# EAGLE design X-A4U-RGB (EAGLE 7.1.0)
REVISION: r2.1
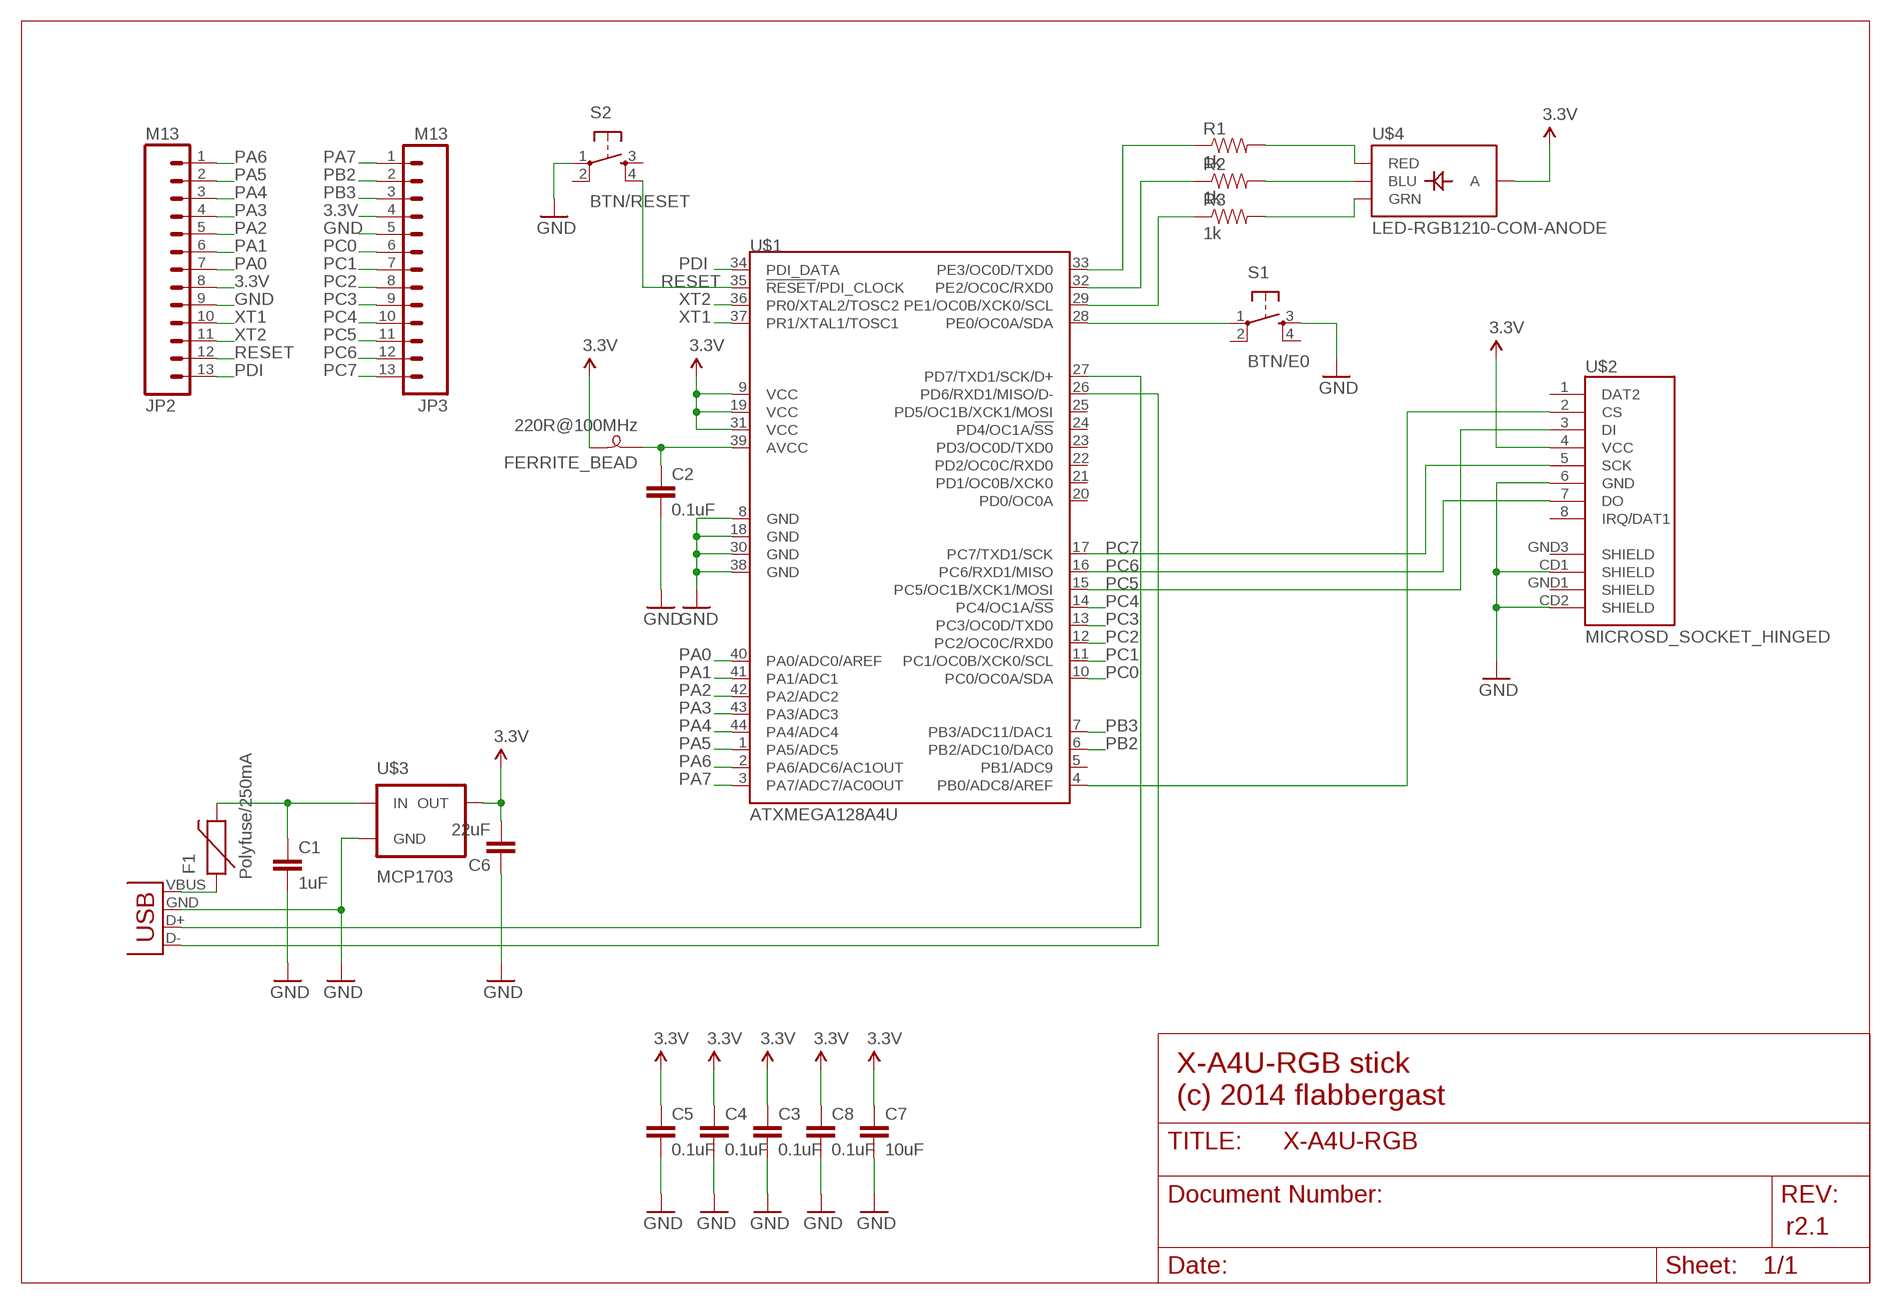
[diagram p0: schematic, sheet 1]

## Parts
C1  1uF  CAPACITOR0805  [0805]
C2  0.1uF  CAPACITOR0805  [0805]
C3  0.1uF  CAPACITOR0805  [0805]
C4  0.1uF  CAPACITOR0805  [0805]
C5  0.1uF  CAPACITOR0805  [0805]
C6  22uF  CAP1206  [1206]
C7  10uF  CAPACITOR1206  [1206]
C8  0.1uF  CAPACITOR1206  [1206]
F1  Polyfuse/250mA  PTCSMD-W  [PTC-1206-WIDE]
FERRITE_BEAD  220R@100MHz  FERRITE-BEAD0805  [0805]
JP1  USB-A-H  [USB-A-H]
JP2  M13  [1X13]
JP3  M13  [1X13]
R1  1k  RESISTOR0805  [0805]
R2  1k  RESISTOR0805  [0805]
R3  1k  RESISTOR0805  [0805]
S1  BTN/E0  TAC_SWITCHSMD  [TACTILE-SWITCH-SMD]
S2  BTN/RESET  TAC_SWITCHSMD  [TACTILE-SWITCH-SMD]
U$1  ATXMEGA128A4U  [TQFP-44]
U$2  MICROSD_SOCKET_HINGED  MICROSD_SOCKET_SLIDE  [MICROSD_SOCKET_SLIDE]
U$3  MCP1703  [SOT-89]
U$4  LED-RGB1210-COM-ANODE  [LED-RGB-1210]

## Nets
3.3V: C3.1 C4.1 C5.1 C6.2 C7.1 C8.1 FERRITE_BEAD.2 JP2.8 JP3.4 U$1.9(VCC) U$1.19(VCC) U$1.31(VCC) U$2.4(VCC) U$3.3(OUT) U$4.A
GND: C1.2 C2.2 C3.2 C4.2 C5.2 C6.1 C7.2 C8.2 JP1.GND(VBUS) JP2.9 JP3.5 S1.3 S2.1 U$1.8(GND) U$1.18(GND) U$1.30(GND) U$1.38(GND) U$2.6(GND) U$2.CD1(SHIELD) U$2.CD2(SHIELD) U$3.1(GND)
N$1: JP1.D+(D-) U$1.27(PD7/TXD1/SCK/D+)
N$2: JP1.D-(D+) U$1.26(PD6/RXD1/MISO/D-)
N$3: F1.1 JP1.VBUS(GND)
N$4: R3.1 U$1.29(PE1/OC0B/XCK0/SCL)
N$5: S1.1 U$1.28(PE0/OC0A/SDA)
N$6: C2.1 FERRITE_BEAD.1 U$1.39(AVCC)
N$7: U$1.4(PB0/ADC8/AREF) U$2.2(CS)
N$9: R2.1 U$1.32(PE2/OC0C/RXD0)
N$10: R1.1 U$1.33(PE3/OC0D/TXD0)
N$11: R1.2 U$4.R(RED)
N$12: R3.2 U$4.G(GRN)
N$13: R2.2 U$4.B(BLU)
PA0: JP2.7 U$1.40(PA0/ADC0/AREF)
PA1: JP2.6 U$1.41(PA1/ADC1)
PA2: JP2.5 U$1.42(PA2/ADC2)
PA3: JP2.4 U$1.43(PA3/ADC3)
PA4: JP2.3 U$1.44(PA4/ADC4)
PA5: JP2.2 U$1.1(PA5/ADC5)
PA6: JP2.1 U$1.2(PA6/ADC6/AC1OUT)
PA7: JP3.1 U$1.3(PA7/ADC7/AC0OUT)
PB2: JP3.2 U$1.6(PB2/ADC10/DAC0)
PB3: JP3.3 U$1.7(PB3/ADC11/DAC1)
PC0: JP3.6 U$1.10(PC0/OC0A/SDA)
PC1: JP3.7 U$1.11(PC1/OC0B/XCK0/SCL)
PC2: JP3.8 U$1.12(PC2/OC0C/RXD0)
PC3: JP3.9 U$1.13(PC3/OC0D/TXD0)
PC4: JP3.10 U$1.14(PC4/OC1A/!SS!)
PC5: JP3.11 U$1.15(PC5/OC1B/XCK1/MOSI) U$2.3(DI)
PC6: JP3.12 U$1.16(PC6/RXD1/MISO) U$2.7(DO)
PC7: JP3.13 U$1.17(PC7/TXD1/SCK) U$2.5(SCK)
PDI: JP2.13 U$1.34(PDI_DATA)
RESET: JP2.12 S2.4 U$1.35(!RESET!/PDI_CLOCK)
VBUS: C1.1 F1.2 U$3.2(IN) U$3.4(IN)
XT1: JP2.10 U$1.37(PR1/XTAL1/TOSC1)
XT2: JP2.11 U$1.36(PR0/XTAL2/TOSC2)
Unconnected: S1.2 S1.4 S2.2 S2.3 U$1.5(PB1/ADC9) U$1.20(PD0/OC0A) U$1.21(PD1/OC0B/XCK0) U$1.22(PD2/OC0C/RXD0) U$1.23(PD3/OC0D/TXD0) U$1.24(PD4/OC1A/!SS!) U$1.25(PD5/OC1B/XCK1/MOSI) U$2.1(DAT2) U$2.8(IRQ/DAT1) U$2.GND1(SHIELD) U$2.GND3(SHIELD)

## Notes on the sheet
- X-A4U-RGB stick
  (c) 2014 flabbergast

## Library data of the parts
C1-C5 C7 C8 = flabbergast:CAPACITOR
C6 = SparkFun-Passives:CAP: Capacitor Standard 0603 ceramic capacitor, and 0.1" leaded capacitor.
F1 = SparkFun-PowerIC:PTC: Resettable Fuse PTC Resettable Fuse. Spark Fun Electronics SKU : COM-08357
FERRITE_BEAD = flabbergast:FERRITE-BEAD
JP1 = SparkFun-Connectors:USB: USB Connectors USB-B-PTH is fully proven SKU : PRT-00139/CONN-08278 USB-miniB is fully proven SKU : PRT-00587 USB-A-PCB is untested. USB-A-H is throughly reviewed, but untested. Spark Fun Electronics SKU : PRT-00437 USB-B-SMT is throughly reviewed, but untested. Needs silkscreen touching up. USB-A-S has not been used/tested USB-MB-H has not been used/tested USB-MICROB has been used. CONN-09505
JP2 JP3 = SparkFun-Connectors:M13: 13-pin single row .1" header
R1-R3 = flabbergast:RESISTOR
S1 S2 = SparkFun-Electromechanical:TAC_SWITCH: Momentary Switch Button commonly used for reset or general input. Spark Fun Electronics SKU : COM-00097 SMT- SWCH-08247; PROD_ID: SWCH-08247; VALUE: TAC_SWITCHSMD
U$1 = flabbergast:ATXMEGA128A4U
U$2 = flabbergast:MICROSD_SOCKET
U$3 = flabbergast:MCP1703
U$4 = flabbergast:LED-RGB

## Board
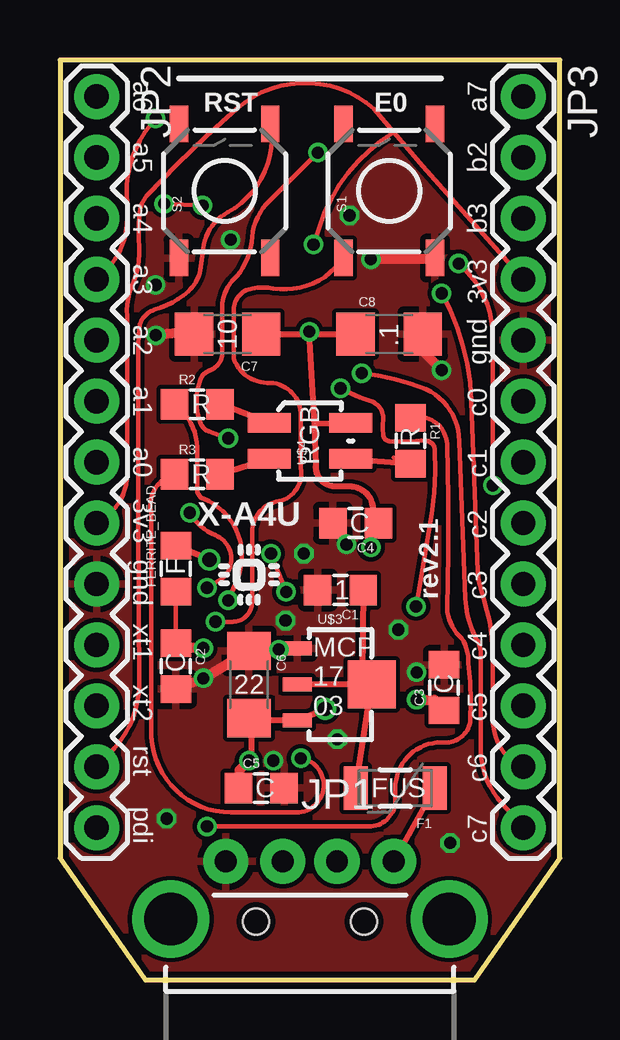
[diagram p1: board, top side]
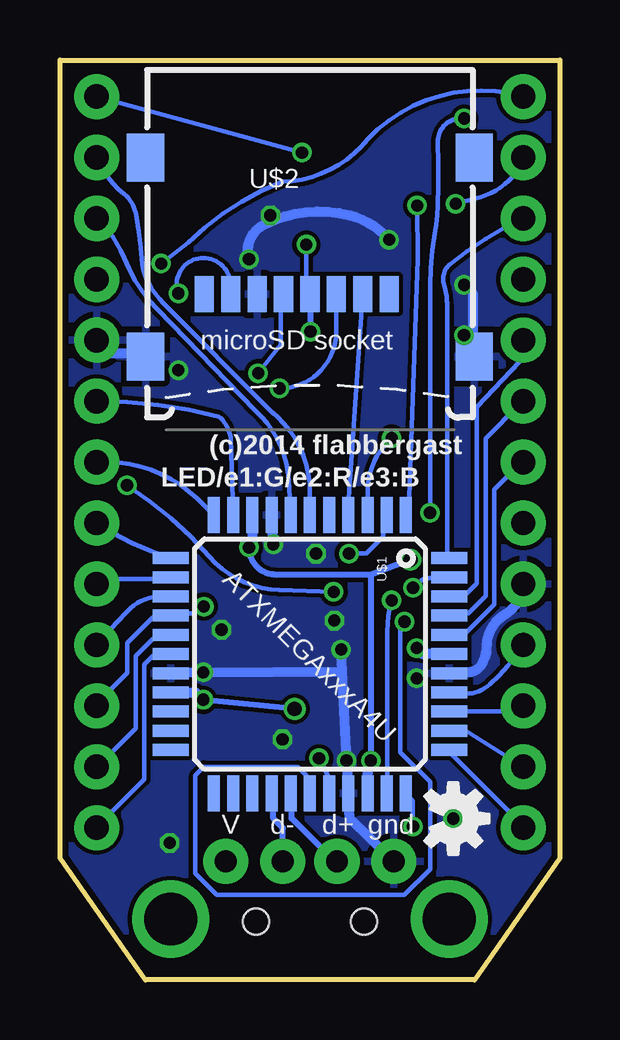
[diagram p2: board, bottom side, seen from below]

Size 20.83 x 38.35 mm. Coordinates in mm from the lower left corner, seen from the top.
Outline: 0,5.08 3.56,0 17.27,0 20.83,5.08 20.83,38.35 0,38.35 0,5.08
Copper layers (1*16): Top 0.035mm / dielectric 1.5mm / Bottom 0.035mm
Design rules "ITEADstudio_DRC *": minimum track width 7mil, minimum drill 20mil, track to track 7mil, track to pad 7mil, pad to pad 7mil, via to via 7mil, smd to smd 0mil, copper to edge 10mil, drill to drill 10mil, minimum pad ring 10mil, minimum via ring 6mil, stop-mask expansion 2mil, vias tented up to drill 100mil, thermal gap 10mil

### Footprints (pad centres in the part's own frame; a part is rotated, then mirrored left to right if it is on the bottom)
0805 = smd 1.143 x 1.27: 1 -0.953,0; 2 0.953,0
1206 = smd 1.6 x 1.8: 1 -1.4,0; 2 1.4,0
PTC-1206-WIDE = smd 1 x 1.8: 1 -1.654,0; 2 1.654,0
USB-A-H = drill 0.914 pad 1.88: D+ 2.4,1.127; D- 2.4,-1.127; GND 2.4,3.5; VBUS 2.4,-3.5 | drill 2.2: GND2 0,-5.8; GND3 0,5.8 | hole 1.1: -0.1,2.25; -0.1,-2.25
1X13 = drill 1.016 pad 1.88: 1 0,0; 2 2.54,0; 3 5.08,0; 4 7.62,0; 5 10.16,0; 6 12.7,0; 7 15.24,0; 8 17.78,0; 9 20.32,0; 10 22.86,0; 11 25.4,0; 12 27.94,0; 13 30.48,0
TACTILE-SWITCH-SMD = smd 1.524 x 0.762: 1 -2.794,1.905; 2 2.794,1.905; 3 -2.794,-1.905; 4 2.794,-1.905
TQFP-44 = smd 1.5 x 0.5: 1 -5.8,4; 2 -5.8,3.2; 3 -5.8,2.4; 4 -5.8,1.6; 5 -5.8,0.8; 6 -5.8,0; 7 -5.8,-0.8; 8 -5.8,-1.6; 9 -5.8,-2.4; 10 -5.8,-3.2; 11 -5.8,-4; 23 5.8,-4; 24 5.8,-3.2; 25 5.8,-2.4; 26 5.8,-1.6; 27 5.8,-0.8; 28 5.8,0; 29 5.8,0.8; 30 5.8,1.6; 31 5.8,2.4; 32 5.8,3.2; 33 5.8,4 | smd 0.5 x 1.5: 12 -4,-5.8; 13 -3.2,-5.8; 14 -2.4,-5.8; 15 -1.6,-5.8; 16 -0.8,-5.8; 17 0,-5.8; 18 0.8,-5.8; 19 1.6,-5.8; 20 2.4,-5.8; 21 3.2,-5.8; 22 4,-5.8; 34 4,5.8; 35 3.2,5.8; 36 2.4,5.8; 37 1.6,5.8; 38 0.8,5.8; 39 0,5.8; 40 -0.8,5.8; 41 -1.6,5.8; 42 -2.4,5.8; 43 -3.2,5.8; 44 -4,5.8
MICROSD_SOCKET_SLIDE = smd 0.8 x 1.5: 1 3.3,-5.7; 2 2.2,-5.7; 3 1.1,-5.7; 4 0,-5.7; 5 -1.1,-5.7; 6 -2.2,-5.7; 7 -3.3,-5.7; 8 -4.4,-5.7 | smd 1.55 x 2: CD1 6.85,-8.3; CD2 -6.85,-8.3; GND1 -6.85,0; GND3 6.85,0
SOT-89 = smd 0.58 x 1.2: 1 -1.5,-1.8; 2 0,-1.8; 3 1.5,-1.8 | smd 2 x 2: 4 0,1.3
LED-RGB-1210 = smd 0.8 x 1.8: A 0.75,-1.7; B 0.75,1.7; G -0.75,1.7; R -0.75,-1.7

### Placement (x,y rotation side)
C1  11.68,16.26 180 top
C2  4.83,13.08 270 top
C3  16,12.19 90 top
C4  12.32,19.05 180 top
C5  8.38,8 0 top
C6  7.87,12.32 270 top
C7  6.98,26.92 180 top
C8  13.72,26.92 0 top
F1  13.97,8 180 top
FERRITE_BEAD  4.83,17.14 90 top
JP1  10.41,2.54 90 top
JP2  1.52,36.83 270 top
JP3  19.3,36.83 270 top
R1  14.61,22.48 270 top
R2  5.71,24 0 top
R3  5.71,21.08 0 top
S1  13.72,32.89 90 top
S2  6.86,32.89 90 top
U$1  10.41,13.59 270 bottom
U$2  10.41,34.29 0 bottom
U$3  11.68,12.32 270 top
U$4  10.41,22.48 90 top
U$5  [OSHW-LOGO-S]  4.45,6.73 270 bottom
U$6  [IC_TINY]  7.87,16.89 0 top

### Tracks (layer width: path | path; a pad name or v marks a point on that pad's centre or on a via)
3.3V  (via drill 0.51, 0.6)
  Top 0.178: v10.39,27.03 10.39,26.92 | 13.06,19.2 C4.1 | 13.91,35.35 15.11,33.93 JP3.4 | 13.91,35.35 13.08,36.32 arc83 7.37,36.32 arc5 3.68,32.77 arc40 3.3,31.88 arc6 3.3,30.48 arc-27 3.05,29.08 arc27 2.79,27.69 2.79,21.08 arc-64 JP2.8 | v10.57,30.66 10.79,31.37 arc-41 13.91,35.35
  Top 0.254: C7.1 10.39,26.92 C8.1 | 7.97,10.82 U$3.3 v11.05,11.3 | 7.97,10.82 C6.2 | 7.97,10.82 7.97,9.24 v7.87,9.14 | 10.41,27 arc90 v10.39,27.03 10.62,23.1 | 13.06,19.2 13.06,19.58 arc90 12.06,20.57 11.43,20.57 arc-90 10.67,21.46 10.62,23.1 | U$4.A 10.62,23.18 10.62,23.1 | v6.22,17.53 FERRITE_BEAD.2
  Top 0.406: v14.86,11.68 15.61,11.68 C3.1 | C5.1 7.48,8.75 v7.87,9.14 | v12.95,18.03 12.95,18.79 C4.1
  Bottom 0.178: 10.39,28.45 U$2.4 10.57,28.63 v10.57,30.66
  Bottom 0.254: v6.22,17.53 7.87,16.89 | 7.87,16.89 v7.87,9.14 | v11.05,11.3 v14.86,11.68 | v10.39,27.03 10.39,28.45 | 7.87,16.89 11.81,16.89 arc90 v12.95,18.03
  Bottom 0.406: U$1.19 15.16,11.99 v14.86,11.68 | U$1.9 12.81,18.17 v12.95,18.03 | U$1.31 8,8.64 v7.87,9.14
GND  (via drill 0.51)
  Top 0.178: 15.54,30.05 S1.3 | 5.59,27.03 C7.2 | 15.19,27.03 C8.2 15.19,26.85 15.19,26.14 | 5.05,30.05 S2.1
  Top 0.406: C4.2 v11.94,18.16 | C2.2 v5.97,12.57 C6.1 v9.12,13.78 U$3.1 | 15.54,30.05 v12.95,30.05 | v15.9,25.43 15.19,26.14 | 5.59,27.03 v4,26.88 | 15.19,27.03 14.86,27.18
  Bottom 0.178: 12.7,29.16 12.7,28.63 U$2.6 | 3.63,26.67 3.63,26.14 v4,26.88 | 17.32,26.14 U$2.CD2 17.14,25.96 17.14,25.25 | 19.28,26.67 JP3.5
  Bottom 0.254: v4,26.88 3.63,26.67
  Bottom 0.406: v11.94,18.16 U$1.8 | U$1.18 v14.86,12.83 9.07,12.86 | 9.07,12.86 v8.89,9.14 U$1.30 8.76,6.73 JP1.GND | 9.07,12.86 v9.12,13.78 | 3.63,26.67 3.63,28.63 v3.99,28.98 | 17.32,26.14 18.75,26.14 19.28,26.67 | 3.63,26.14 U$2.CD1 | U$1.38 arc13 3.81,12.83 arc-69 3.17,13.34 arc-26 3.05,13.84 arc61 2.29,15.24 arc-56 JP2.9 | v12.95,30.05 arc79 12.32,31.5 arc41 8.76,31.88 arc34 v7.11,30.86
  other vias: 4.45,6.73 16.26,5.71 14.1,14.61 9.4,14.99 10.16,17.78 12.06,31.88 11.56,10.03
  pour Top: 0.25,38.1 0.25,5.08 4.06,0 16.76,0 20.57,5.08 20.57,38.1
  pour Bottom: 0.25,38.1 0.25,5.08 4.06,0 16.76,0 20.57,5.08 20.57,38.1
N$1
  Bottom 0.254: JP1.D+ 9.38,4.94 11.18,6.73 11.18,7.75 U$1.27
N$2
  Bottom 0.254: JP1.D- 11.54,6.33 11.94,6.73 11.94,7.71 U$1.26
N$3
  Top 0.254: F1.1 JP1.VBUS
N$4  (via drill 0.51)
  Top 0.178: 5.23,20.8 R3.1 arc90 3.81,19.44 3.81,10.13 arc87 7.11,6.99 arc1 9.86,6.99 arc170 v10.03,9.25
  Bottom 0.178: U$1.29 9.68,7.82 9.68,8.53 v10.03,9.25
N$5  (via drill 0.51)
  Top 0.178: v6.48,14.94 7.19,14.94 arc90 8,15.75 8,18.67 arc-77 9.02,19.94 arc93 10.03,21.34 10.03,23.65 arc89 8.64,24.89 arc-70 7.24,25.91 7.24,27.94 arc-81 8,28.83 arc-18 8.89,28.83 arc65 S1.1
  Bottom 0.178: v6.48,14.94 6.65,14.76 6.65,9.5 5.41,8.26 5.41,4.62 6.48,3.56 14.3,3.56 15.19,4.45 15.19,8.53 14.83,8.89 10.92,8.89 10.57,8.53 10.57,7.82 U$1.28
N$6  (via drill 0.51)
  Top 0.178: C2.1 FERRITE_BEAD.1
  Top 0.406: v5.97,13.84 5.22,13.84 C2.1
  Bottom 0.406: U$1.39 5.71,13.59 v5.97,13.84
N$7
  Bottom 0.178: 8.25,28.45 U$2.2 8.79,20.09 8.79,19.56 U$1.4
N$9  (via drill 0.51)
  Top 0.178: v7.01,15.82 7.37,16.64 arc92 5.97,20.07 arc-70 5.71,20.45 arc3 5.71,22.23 arc54 R2.1
  Bottom 0.178: U$1.32 7.19,7.82 7.19,14.53 arc16 v7.01,15.82
N$10  (via drill 0.51)
  Top 0.178: v6.12,6.4 12.88,6.4 arc90 13.97,7.49 13.97,8 arc-90 15.88,9.91 16.03,9.91 arc90 17.09,10.85 arc11 17.02,13.21 arc33 16.74,14.25 arc-46 16.13,15.49 arc4 16.13,22.35 arc103 R1.1 14.12,23.29
  Bottom 0.178: v6.12,6.4 6.12,7.47 6.3,7.64 U$1.33
N$11
  Top 0.178: 13.9,21.78 R1.2
  Top 0.254: U$4.R R1.2
N$12
  Top 0.254: U$4.G R3.2
N$13
  Top 0.254: U$4.B R2.2
PA0
  Bottom 0.178: U$1.40 4.52,14.4 3.99,14.4 2.74,15.65 2.74,20.45 1.68,21.51 JP2.7
PA1
  Bottom 0.178: U$1.41 4.52,15.29 3.81,15.29 3.1,16 3.1,22.58 1.68,24 JP2.6
PA2
  Bottom 0.178: U$1.42 4.52,16 3.99,16 3.45,16.54 3.45,23.88 1.68,25.78 1.68,26.67 JP2.5
PA3  (via drill 0.51)
  Top 0.178: v6.12,16.36 6.6,16.64 arc127 6.48,18.54 arc-38 v5.41,19.48 | v3.99,35.92 arc48 2.79,32.38 arc-21 2.67,30.86 arc-28 2.03,29.72 1.68,29.34 JP2.4
  Bottom 0.178: v5.41,19.48 5.41,28.96 arc11 5.21,31.11 arc-9 5.08,32.26 arc-4 5.08,34.92 arc99 v3.99,35.92 | U$1.43 5.33,16.76 arc-51 v6.12,16.36
PA4
  Bottom 0.178: U$1.44 4.7,17.6 4.7,28.19 arc-19 4.83,28.96 arc70 4.57,29.84 arc14 JP2.3
PA5  (via drill 0.51)
  Top 0.178: v4.34,32.36 v5.94,32.28
  Bottom 0.178: v5.94,32.28 5.92,30.02 6.3,19.56 U$1.1 | v4.34,32.36 3.3,32.64 arc-56 JP2.2
PA6  (via drill 0.51)
  Top 0.178: v18.03,20.62 18.03,26.8 arc50 v16.61,29.87 | v9.42,16.18 v8.79,17.78
  Bottom 0.178: v8.79,17.78 8.08,17.78 7.37,18.49 7.37,19.38 U$1.2 | 1.68,36.8 JP2.1 arc-63 8,35.05 arc49 11.56,33.27 arc-23 15.49,30.73 v16.61,29.87 | v9.42,16.18 11.68,16.26 arc47 14.61,17.65 arc-16 v18.03,20.62
PA7  (via drill 0.51)
  Top 0.178: v10.74,34.49 8.89,32.64 arc45 8,30.99 arc-37 7.37,29.34 arc42 6.76,28.19 6.76,26.04 arc-61 6.22,25.4 arc51 5.84,25.02 arc39 5.84,23.24 arc51 6.22,22.86 v7.01,22.58
  Bottom 0.178: 19.28,36.8 JP3.1 v10.74,34.49 | U$1.3 8,20.45 arc48 v7.01,22.58
PB2
  Bottom 0.178: 12.06,23.75 16.51,28.19 arc22 17.27,29.34 arc17 17.4,29.84 arc-3 17.65,31.88 arc-42 18.16,32.77 arc28 JP3.2 | 12.06,23.75 11.94,23.62 | U$1.6 10.41,20.32 arc-51 12.06,23.75
PB3
  Bottom 0.178: U$1.7 11.3,20.83 arc-46 12.7,23.75 16.76,27.94 arc22 18.16,30.1 arc-26 JP3.3
PC0
  Bottom 0.178: U$1.10 13.72,22.61 arc-42 14.22,23.5 arc-14 JP3.6
PC1
  Bottom 0.178: 19.28,21.51 JP3.7 arc48 15.11,20.07 U$1.11
PC2
  Bottom 0.178: U$1.12 16.26,17.6 arc16 JP3.8
PC3
  Bottom 0.178: JP3.9 19.1,16.71 16.26,16.71 U$1.13
PC4
  Bottom 0.178: 19.28,14.05 JP3.10 arc3 18.03,15.37 arc51 16.38,16 U$1.14
PC5  (via drill 0.51)
  Top 0.178: v14.83,15.57 15.49,19.43 arc11 15.62,22.1 arc84 15.24,22.48 arc11 14.66,22.45 13.79,22.45 arc-90 13.46,22.73 arc-10 13.46,23.37 arc77 12.95,24.13 arc-10 v11.68,24.66
  Bottom 0.178: JP3.11 19.28,11.56 18.03,12.8 18.03,14.05 16.97,15.11 16.26,15.11 U$1.15 16.08,15.29 15.37,15.29 v14.83,15.57 | 9.32,28.45 U$2.3 9.31,27.03 arc90 v11.68,24.66
PC6  (via drill 0.51)
  Top 0.178: JP3.12 19.28,8.89 arc-39 18.92,9.02 arc-51 18.03,10.92 18.03,13.51 arc18 17.65,15.88 arc-12 17.4,17.02 17.14,24.13 arc27 v15.9,28.63
  Bottom 0.178: U$1.16 16.26,14.22 16.97,14.22 17.68,13.51 17.68,10.49 19.28,8.89 JP3.12 | U$2.7 13.72,28.96 arc-89 14.86,30.1 arc-110 v15.9,28.63
PC7  (via drill 0.51)
  Top 0.178: JP3.13 19.28,6.4 18.42,7.37 arc-39 17.53,9.53 17.53,13.59 arc37 17.27,14.35 arc-21 16.89,15.88 16.64,22.48 arc64 15.24,24.64 arc16 v12.57,25.3
  Bottom 0.178: v12.57,25.3 11.63,26.49 11.63,28.45 U$2.5 | U$1.17 16.26,13.51 16.97,13.51 17.32,13.16 17.32,8.36 19.28,6.4 JP3.13
PDI
  Bottom 0.178: U$1.34 4.52,9.42 1.5,6.4 JP2.13
RESET
  Top 0.178: 8.61,35.56 S2.4 arc-72 6.98,32 arc56 5.97,30.48 arc-5 5.84,29.59 arc-39 5.33,28.7 arc-25 3.94,27.94 arc68 3.3,27.18 arc6 3.25,26.19 3.25,19.3 3.3,12.06 arc-39 2.03,9.4 JP2.12
  Bottom 0.178: 4.52,10.31 U$1.35 3.94,10.41 JP2.12
VBUS
  Top 0.254: U$3.4 U$3.2 | C1.1 12.58,12.72 U$3.4 | F1.2 U$3.4
XT1
  Bottom 0.178: U$1.37 4.06,11.94 arc-47 2.92,12.32 arc-15 JP2.10
XT2
  Bottom 0.178: U$1.36 4.52,11.2 1.85,11.2 1.68,11.38 JP2.11

### Text on the board
tPlace: a6 | RST | E0 | a7 | a5 | b2 | a4 | b3 | a3 | 3v3 | a2 | 10 | .1 | gnd | a1 | R | c0 | a0 | R | R | RGB | c1 | 3v3 | X-A4U | C | gnd | c2 | F | 1 | rev2.1 | c3 | xt1 | C | c4 | xt2 | 22 | C | MCP / 17 / 03 | c5 | rst | C | FUS | c6 | pdi | c7
bPlace: microSD socket | (c)2014 flabbergast | LED/e1:G/e2:R/e3:B | ATXMEGAxxxA4U | gnd | d+ | d- | V